# Altium schematic sheet Debug_JTAG.SchDoc: Debug JTAG
size A4
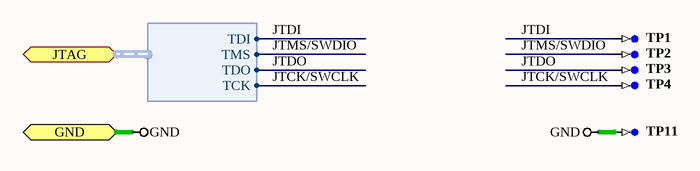
[diagram p0: Debug_JTAG.SchDoc]

## Parts
TP1  TP-SM-C-100  [TP-SM-C-100]  (value not drawn)  (no BOM)
TP2  TP-SM-C-100  [TP-SM-C-100]  (value not drawn)  (no BOM)
TP3  TP-SM-C-100  [TP-SM-C-100]  (value not drawn)  (no BOM)
TP4  TP-SM-C-100  [TP-SM-C-100]  (value not drawn)  (no BOM)
TP11  TP-SM-C-100  [TP-SM-C-100]  (value not drawn)  (no BOM)

## Ports
GND, JTAG (harness JTAG)

## Harnesses
JTAG: TMS, TCK, TDI, TDO

## Nets
GND: TP11.1 ; port GND
JTCK/SWCLK: TP4.1 ; port JTAG.TCK
JTDI: TP1.1 ; port JTAG.TDI
JTDO: TP3.1 ; port JTAG.TDO
JTMS/SWDIO: TP2.1 ; port JTAG.TMS

## Notes on the sheet
- Sheet Title
- Project Title
- Size:
- Date:
- A4
- Item:
- Time:
- Revision:
- Sheet
- of
- File:

## Library data of the parts
TP1-TP4 TP11 = CMP-0484-00002-1: Test Point, Surface Mount, Circular, Pad Diameter 1 mm